# Altium schematic sheet Transformer.SchDoc
size 406 x 304 mm; SheetNumber: 3; SheetTotal: 10
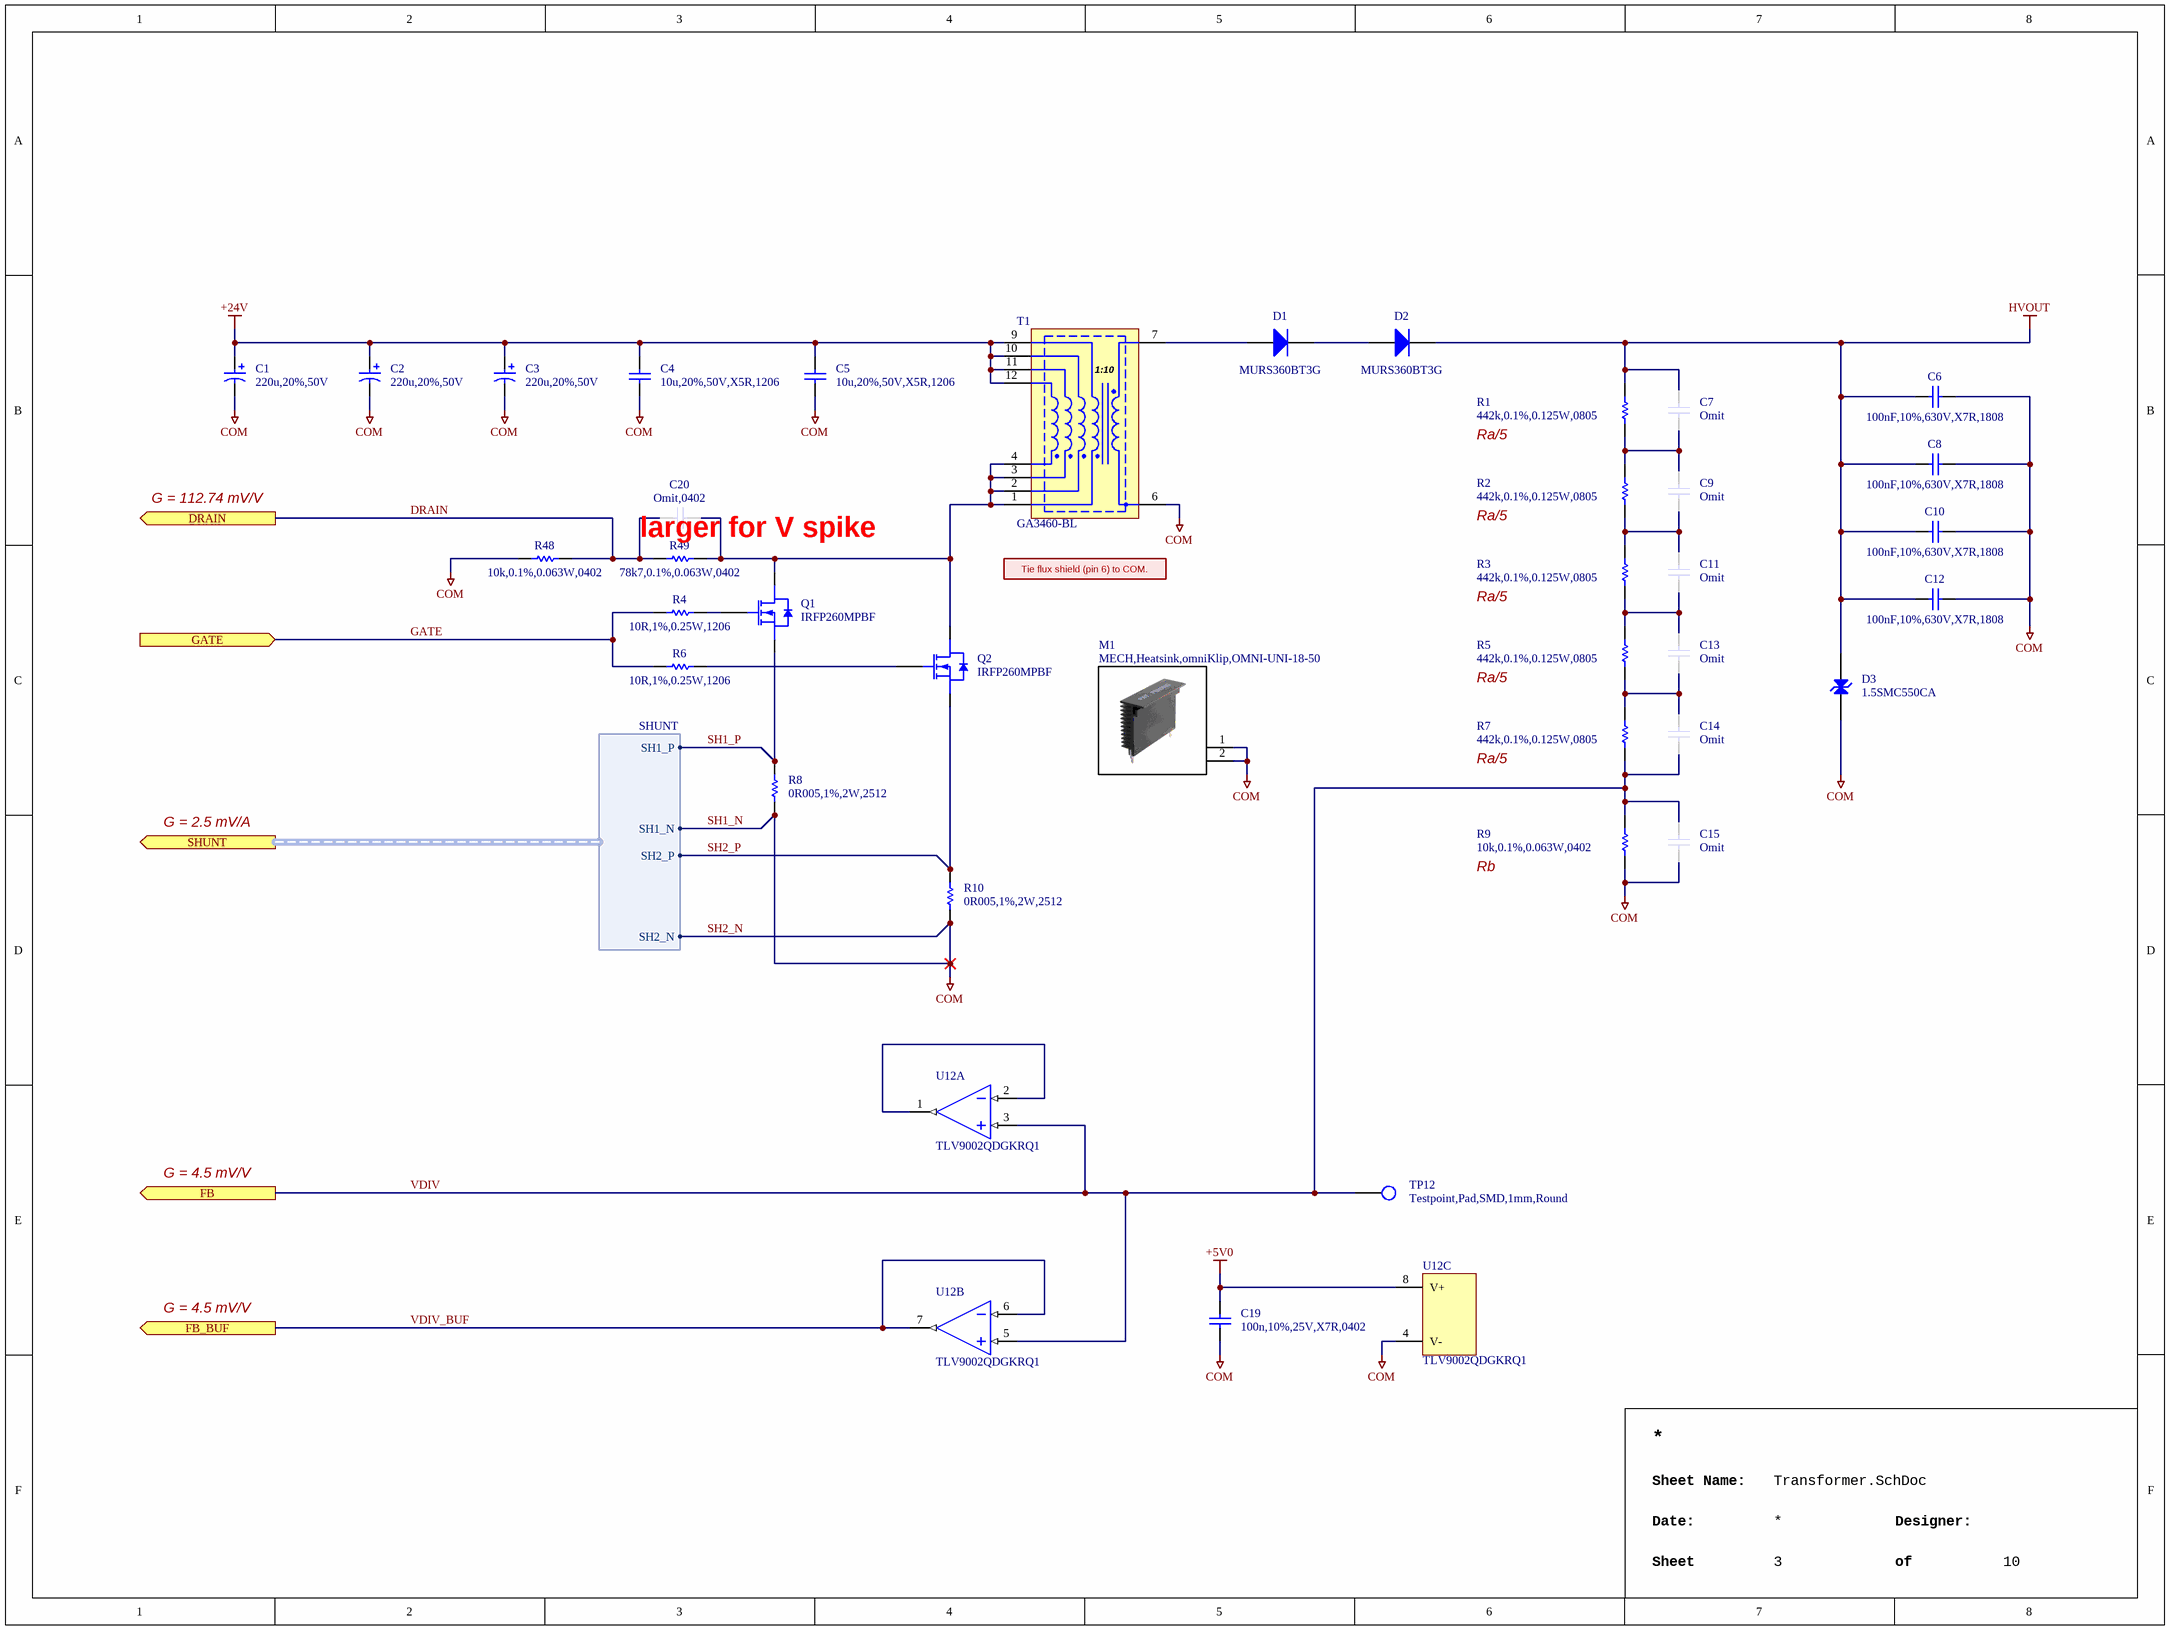
[diagram p0: Transformer.SchDoc]

## Parts
C1  220u,20%,50V  [CAPPR500W60D1000H1600B]
C2  220u,20%,50V  [CAPPR500W60D1000H1600B]
C3  220u,20%,50V  [CAPPR500W60D1000H1600B]
C4  10u,20%,50V,X5R,1206  [CAPC3216X16N]
C5  10u,20%,50V,X5R,1206  [CAPC3216X16N]
C6  100nF,10%,630V,X7R,1808  [KEMET_PKG_LC]
C7  Omit  [CAPC_0805]  (no BOM)
C8  100nF,10%,630V,X7R,1808  [KEMET_PKG_LC]
C9  Omit  [CAPC_0805]  (no BOM)
C10  100nF,10%,630V,X7R,1808  [KEMET_PKG_LC]
C11  Omit  [CAPC_0805]  (no BOM)
C12  100nF,10%,630V,X7R,1808  [KEMET_PKG_LC]
C13  Omit  [CAPC_0805]  (no BOM)
C14  Omit  [CAPC_0805]  (no BOM)
C15  Omit  [CAPC_0805]  (no BOM)
C19  100n,10%,25V,X7R,0402  [CAPC1005X06N]
C20  Omit,0402  [CAPC1005X06N]  (no BOM)
D1  MURS360BT3G  [ONSEMI_SMB]
D2  MURS360BT3G  [ONSEMI_SMB]
D3  1.5SMC550CA  [LITTELFUSE_DO-214AB]
M1  MECH,Heatsink,omniKlip,OMNI-UNI-18-50  [WAKEFIELD_OMNI-UNI-18-50]
Q1  IRFP260MPBF  [INFINEON_PKG_TO247AD]
Q2  IRFP260MPBF  [INFINEON_PKG_TO247AD]
R1  442k,0.1%,0.125W,0805  [RESC2012X07N]
R2  442k,0.1%,0.125W,0805  [RESC2012X07N]
R3  442k,0.1%,0.125W,0805  [RESC2012X07N]
R4  10R,1%,0.25W,1206  [RESC3216X06N]
R5  442k,0.1%,0.125W,0805  [RESC2012X07N]
R6  10R,1%,0.25W,1206  [RESC3216X06N]
R7  442k,0.1%,0.125W,0805  [RESC2012X07N]
R8  0R005,1%,2W,2512  [OHMITE_PKG_MCS3264]
R9  10k,0.1%,0.063W,0402  [RESC1005X04N]
R10  0R005,1%,2W,2512  [OHMITE_PKG_MCS3264]
R48  10k,0.1%,0.063W,0402  [RESC1005X04N]
R49  78k7,0.1%,0.063W,0402  [RESC1005X04N]
T1  GA3460-BL  [COILCRAFT_GA3460-BL]
TP12  Testpoint,Pad,SMD,1mm,Round  [TP100]
U12  TLV9002QDGKRQ1  [SOP65P490X110-8]  (parts A,B,C of 3)

## Ports
DRAIN (out), FB (out), FB_BUF (out), GATE (in), SHUNT (out, harness SHUNT)

## Harnesses
SHUNT: SH1_P, SH1_N, SH2_P, SH2_N

## Nets
+5V0: C19.2 U12.8(V+)
+24V: C1.1 C2.1 C3.1 C4.2 C5.2 T1.9 T1.10 T1.11 T1.12
HVOUT: C6.2 C7.2 C8.2 C10.2 C12.2 D2.1(K) D3.1(K) R1.2
SH1_N: C1.2 C2.2 C3.2 C4.1 C5.1 C6.1 C8.1 C10.1 C12.1 C15.1 C19.1 D3.2(A) M1.1 M1.2 R8.1 R9.1 R10.1 R48.2 T1.6 U12.4(V-) ; port SHUNT.SH1_N, port SHUNT.SH2_N  [also labelled COM, SH2_N]
DRAIN: C20.1 R48.1 R49.1 ; port DRAIN
GATE: R4.1 R6.1 ; port GATE
SH1_P: Q1.3(S) R8.2 ; port SHUNT.SH1_P
SH2_P: Q2.3(S) R10.2 ; port SHUNT.SH2_P
VDIV: C14.1 C15.2 R7.1 R9.2 TP12.1(TP) U12.3(IN1+) U12.5(IN2+) ; port FB
VDIV_BUF: U12.6(IN2-) U12.7(OUT2) ; port FB_BUF
NetC7_1: C7.1 C9.2 R1.1 R2.2
NetC9_1: C9.1 C11.2 R2.1 R3.2
NetC11_1: C11.1 C13.2 R3.1 R5.2
NetC13_1: C13.1 C14.2 R5.1 R7.2
NetC20_2: C20.2 Q1.2(D) Q2.2(D) R49.2 T1.1 T1.2 T1.3 T1.4
NetD1_1: D1.1(K) D2.2(A)
NetD1_2: D1.2(A) T1.7
NetQ1_1: Q1.1(G) R4.2
NetQ2_1: Q2.1(G) R6.2
NetU12_1: U12.1(OUT1) U12.2(IN1-)

## Notes on the sheet
- Ra/5
- G = 112.74 mV/V
- (near C20) larger for V spike
- Tie flux shield (pin 6) to COM.
- G = 2.5 mV/A
- Rb
- G = 4.5 mV/V
- Sheet Name:
- Date:
- Sheet
- Designer:
- of
- (in symbol XFR,Flyback,COILCRAFT_GA3460-BL) 1:10

## Library data of the parts
C1-C3 = CAP,Alum,220uF,20%,50VDC,Radial,Thru: 220 ï¿½F 50 V Aluminum Electrolytic Capacitors Radial, Can 5000 Hrs @ 105ï¿½C; Manufacturer 1: Rubycon; Manufacturer 1 Part Number: 50YXG220MEFCT810X16; Vendor 1 Part Number: 1189-3771-1-ND; Vendor 1: Digikey; Part Name: CAP,Alum,220uF,20%,50VDC,Radial,Thru; CreatedBy: Judd Foster; HelpURL: https://www.rubycon.co.jp/wp-content/uploads/catalog-aluminum/YXG.pdf; Value: 220u
C4 C5 = CAP,Cer,10uF,50VDC,X5R,1206: 10ï¿½F ï¿½20% 50V Ceramic Capacitor X5R 1206 (3216 Metric); Manufacturer 1: Samsung Electro-Mechanics; Manufacturer 1 Part Number: CL31A106MBHNNNE; Vendor 1 Part Number: 1276-6736-1-ND; Vendor 1: Digikey; Part Name: CAP,Cer,10uF,50VDC,X5R,1206; CreatedBy: Judd Foster; HelpURL: https://www.samsungsem.com/resources/file/global/support/product_catalog/MLCC.pdf; Value: 10u
C6 C8 C10 C12 = CAP,Cer,100nF,10%,630V,X7R,1808: 0.1 ÂµF Â±10% 630V Ceramic Capacitor X7R 1808 (4520 Metric); Manufacturer 1: KEMET; Manufacturer 1 Part Number: C1808C104KBRAC7800; Vendor 1 Part Number: 399-C1808C104KBRAC7800CT-ND; Vendor 1: DigiKey; Part Name: CAP,Cer,100nF,10%,630V,X7R,1808; CreatedBy: Judd Foster; HelpURL: https://content.kemet.com/datasheets/KEM_C1010_X7R_HV_SMD.pdf; Value: 100nF
C7 C9 C11 C13-C15 = CAP,Omit,0805: Part Name: CAP,Omit,0805; CreatedBy: Judd Foster; HelpURL: N/A; Manufacturer 1: N/A; Manufacturer 1 Part Number: N/A; Vendor 1: N/A; Vendor 1 Part Number: N/A; Value: Omit
C19 = CAP,Cer,100nF,10%,25V,X7R,0402: 0.1ï¿½F ï¿½10% 25V Ceramic Capacitor X7R 0402 (1005 Metric); Manufacturer 1: Murata Electronics; Manufacturer 1 Part Number: GRM155R71E104KE14J; Vendor 1 Part Number: 490-14603-1-ND; Vendor 1: DigiKey; Value: 100nF; Part Name: CAP,Cer,100nF,10%,25V,X7R,0402; CreatedBy: Judd Foster; HelpURL: https://search.murata.co.jp/Ceramy/image/img/A01X/G101/ENG/GRM155R71E104KE14-01.pdf
C20 = CAP,Omit,0402: Omit; Part Name: CAP,Omit,0402; CreatedBy: Judd Foster; HelpURL: N/A; Manufacturer 1: N/A; Manufacturer 1 Part Number: N/A; Vendor 1: N/A; Vendor 1 Part Number: N/A; Value: Omit
D1 D2 = Diode,Gen,600V,3A,SMB: Diode 600 V 3A Surface Mount SMB; Manufacturer 1: onsemi; Vendor 1 Part Number: MURS360BT3GOSCT-ND; Vendor 1: Digikey; Part Name: Diode,Gen,600V,3A,SMB; CreatedBy: Judd Foster; HelpURL: https://www.onsemi.com/pdf/datasheet/murs360bt3-d.pdf; Manufacturer 1 Part Number: MURS360BT3G
D3 = DIODE,TVS,495VWM,SMD: 760V Clamp 2A Ipp Tvs Diode Surface Mount DO-214AB (SMCJ); Manufacturer 1: Littelfuse Inc.; Vendor 1 Part Number: 1.5SMC550CACT-ND; Vendor 1: Digikey; Part Name: DIODE,TVS,495VWM,SMD; CreatedBy: Judd Foster; HelpURL: https://www.littelfuse.com/~/media/electronics/datasheets/tvs_diodes/littelfuse_tvs_diode_1_5smc_datasheet.pdf.pdf; Manufacturer 1 Part Number: 1.5SMC550CA
M1 = MECH,Heatsink,omniKlip,OMNI-UNI-18-50: Heat Sinks omniKlip Heat Sink for TO-247, TO-264, 18mm Wide, 50mm Long, Aluminum; Manufacturer 1: Wakefield Thermal; Vendor 1 Part Number: 567-OMNI-UNI-18-50; Vendor 1: Mouser; Part Name: MECH,Heatsink,omniKlip,OMNI-UNI-18-50; CreatedBy: Judd Foster; HelpURL: https://www.mouser.com/datasheet/2/433/omniKlip_Wakefield_Vette-3050203.pdf; Manufacturer 1 Part Number: OMNI-UNI-18-50
Q1 Q2 = MOSFET,N Ch,200V,50A,IRFP260MPBF: N-Channel 200 V 50A (Tc) 300W (Tc) Through Hole TO-247AC; Manufacturer 1: Infineon Technologies; Vendor 1 Part Number: IRFP260MPBF-ND; Vendor 1: DigiKey; Part Name: MOSFET,N Ch,200V,50A,IRFP260MPBF; CreatedBy: Judd Foster; HelpURL: https://www.infineon.com/dgdl/irfp260mpbf.pdf?fileId=5546d462533600a40153562894e91fe0; Manufacturer 1 Part Number: IRFP260MPBF
R1-R3 R5 R7 = RES,442k,0.1%,0.125W,0805: 442 kOhms Â±0.1% 0.125W, 1/8W Chip Resistor 0805 (2012 Metric) Automotive AEC-Q200 Thin Film; Manufacturer 1: Panasonic Electronic Components; Manufacturer 1 Part Number: ERA-6AEB4423V; Vendor 1 Part Number: P442KDACT-ND; Vendor 1: DigiKey; Part Name: RES,442k,0.1%,0.125W,0805; CreatedBy: Judd Foster; HelpURL: https://industrial.panasonic.com/cdbs/www-data/pdf/RDM0000/AOA0000C307.pdf; Value: 442k
R4 R6 = RES,10R,1%,0.25W,1206: 10 ï¿½1% 0.25W, 1/4W Chip Resistor 1206 (3216 Metric) Automotive AEC-Q200, Moisture Resistant Thick Film; Manufacturer 1: TE Connectivity Passive Product; Manufacturer 1 Part Number: CRGCQ1206F10R; Vendor 1 Part Number: A129786CT-ND; Vendor 1: Digikey; Part Name: RES,10R,1%,0.25W,1206; CreatedBy: Judd Foster; HelpURL: https://www.te.com/commerce/DocumentDelivery/DDEController?Action=srchrtrv&DocNm=1773204-3&DocType=DS&DocLang=English; Value: 10R
R8 R10 = RES,0R005,1%,2W,2512: 5 mOhms Â±1% 2W Chip Resistor 2512 (6432 Metric) Current Sense, Flame Retardant Coating, Safety Metal Element; Manufacturer 1: Ohmite; Manufacturer 1 Part Number: MCS3264R005FER; Vendor 1 Part Number: MCS3264R005FERCT-ND; Vendor 1: DigiKey; Value: 5m; Part Name: RES,0R005,1%,2W,2512; CreatedBy: Judd Foster; HelpURL: https://www.ohmite.com/assets/images/res-mcs.pdf
R9 R48 = RES,10k,0.1%,0.063W,0402: 10 kOhms ï¿½0.1% 0.1W, 1/10W Chip Resistor 0402 (1005 Metric) Automotive AEC-Q200 Thin Film; Manufacturer 1: Stackpole Electronics Inc; Manufacturer 1 Part Number: RNCF0402BTE10K0; Vendor 1 Part Number: RNCF0402BTE10K0CT-ND; Vendor 1: Digikey; Part Name: RES,10k,0.1%,0.063W,0402; CreatedBy: Judd Foster; HelpURL: https://www.seielect.com/catalog/sei-rncf.pdf; Value: 10k
R49 = RES,78k7,0.1%,0.063W,0402: 78.7 kOhms ï¿½0.1% 0.063W, 1/16W Chip Resistor 0402 (1005 Metric) Thin Film; Manufacturer 1: Yageo; Manufacturer 1 Part Number: RT0402BRD0778K7L; Vendor 1 Part Number: YAG4311CT-ND; Vendor 1: Digikey; Part Name: RES,78k7,0.1%,0.063W,0402; CreatedBy: Judd Foster; HelpURL: https://www.yageo.com/upload/media/product/productsearch/datasheet/rchip/PYu-RT_1-to-0.01_RoHS_L_13.pdf; Value: 78k7
T1 = XFR,Flyback,COILCRAFT_GA3460-BL: Audio Transformers / Signal Transformers GA3460 for LT3751 500V 50A; Vendor 1 Part Number: 994-GA3460-BL; Vendor 1: Mouser; Part Name: XFR,Flyback,COILCRAFT_GA3460-BL; CreatedBy: Judd Foster; HelpURL: https://www.mouser.ca/datasheet/2/597/ga3459-463457.pdf; Manufacturer 1: Coilcraft; Manufacturer 1 Part Number: GA3460-BL
TP12 = Testpoint,Pad,SMD: PCB Testpoint 1mm Round; Part Name: Testpoint,Pad,SMD; CreatedBy: Judd Foster; HelpURL: N/A; Manufacturer 1: N/A; Manufacturer 1 Part Number: N/A; Vendor 1: N/A; Vendor 1 Part Number: N/A
U12 = TLV9002QDGKRQ1: General Purpose Amplifier Circuit Rail-to-Rail 8-VSSOP; Manufacturer 1: Texas Instruments; Vendor 1 Part Number: 296-TLV9002QDGKRQ1CT-ND; Vendor 1: Digikey; Part Name: TLV9002QDGKRQ1; CreatedBy: Judd Foster; HelpURL: https://www.ti.com/lit/ds/symlink/tlv9001-q1.pdf?ts=1702270446565&ref_url=https%253A%252F%252Fwww.google.com%252F; Manufacturer 1 Part Number: TLV9002QDGKRQ1